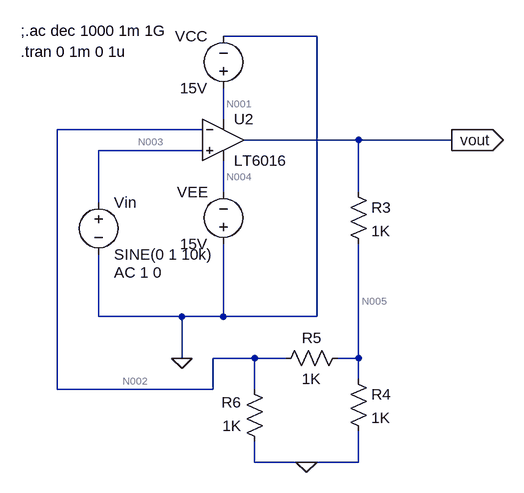
[diagram p0: schematic non-inverting amp opamp 1.asc]
* non-inverting amp opamp 1.asc
* U2: LT6016 (symbol OpAmps\LT6016 not available, pins judged from their places): In+=N003 In-=N002 V+=N001 V-=N004 OUT=vout
Vin N003 0 SINE(0 1 10k) AC 1 0
VCC N001 0 15V
VEE 0 N004 15V
R3 vout N005 1K
R4 N005 0 1K
R5 N005 N002 1K
R6 0 N002 1K
.tran 0 1m 0 1u
;.ac dec 1000 1m 1G
.backanno
.end

* Results of the author's LTspice run, read from the files saved beside the schematic
* Operating Point, zero values left out:
*   V(n004) = -15 V
*   V(n001) = 15 V
*   V(vout) = 5.201 µV
*   V(n002) = -20.2 nV
*   V(n005) = 1.727 µV
*   I(R6) = 20.2 pA
*   I(R5) = 1.747 nA
*   I(R4) = 1.727 nA
*   I(R3) = 3.474 nA
*   I(Vee) = -345.9 µA
*   I(Vcc) = -345.9 µA
*   I(Vin) = -1.767 nA
*   Ix(u2:1) = 1.767 nA
*   Ix(u2:2) = 1.767 nA
*   Ix(u2:3) = 345.9 µA
*   Ix(u2:4) = -345.9 µA
*   Ix(u2:5) = -3.46 nA
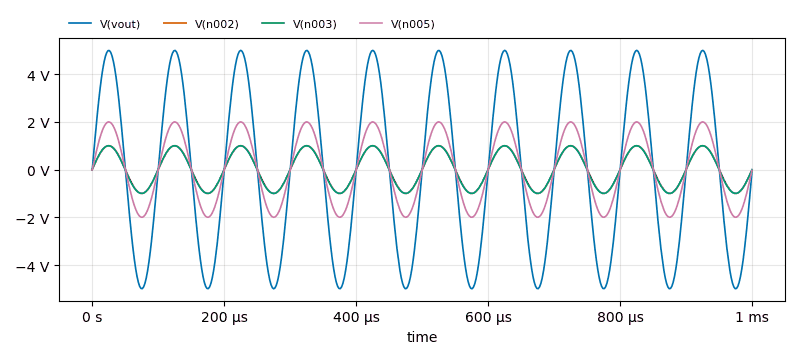
[diagram p1: Transient Analysis of non-inverting amp opamp 1.asc, plotted from the saved traces]
* Transient Analysis, 1 run:
*   V(vout): min -4.995 V, max 4.995 V, average 21.04 mV, rms 3.531 V, last -74.64 mV
*   V(n002): min -999 mV, max 999.1 mV, average 4.207 mV, rms 706.2 mV, last -15.12 mV
*   V(n003): min -1 V, max 999.8 mV, average 50.83 µV, rms 707 mV, last 0 V
*   V(n005): min -1.998 V, max 1.998 V, average 8.417 mV, rms 1.412 V, last -29.92 mV